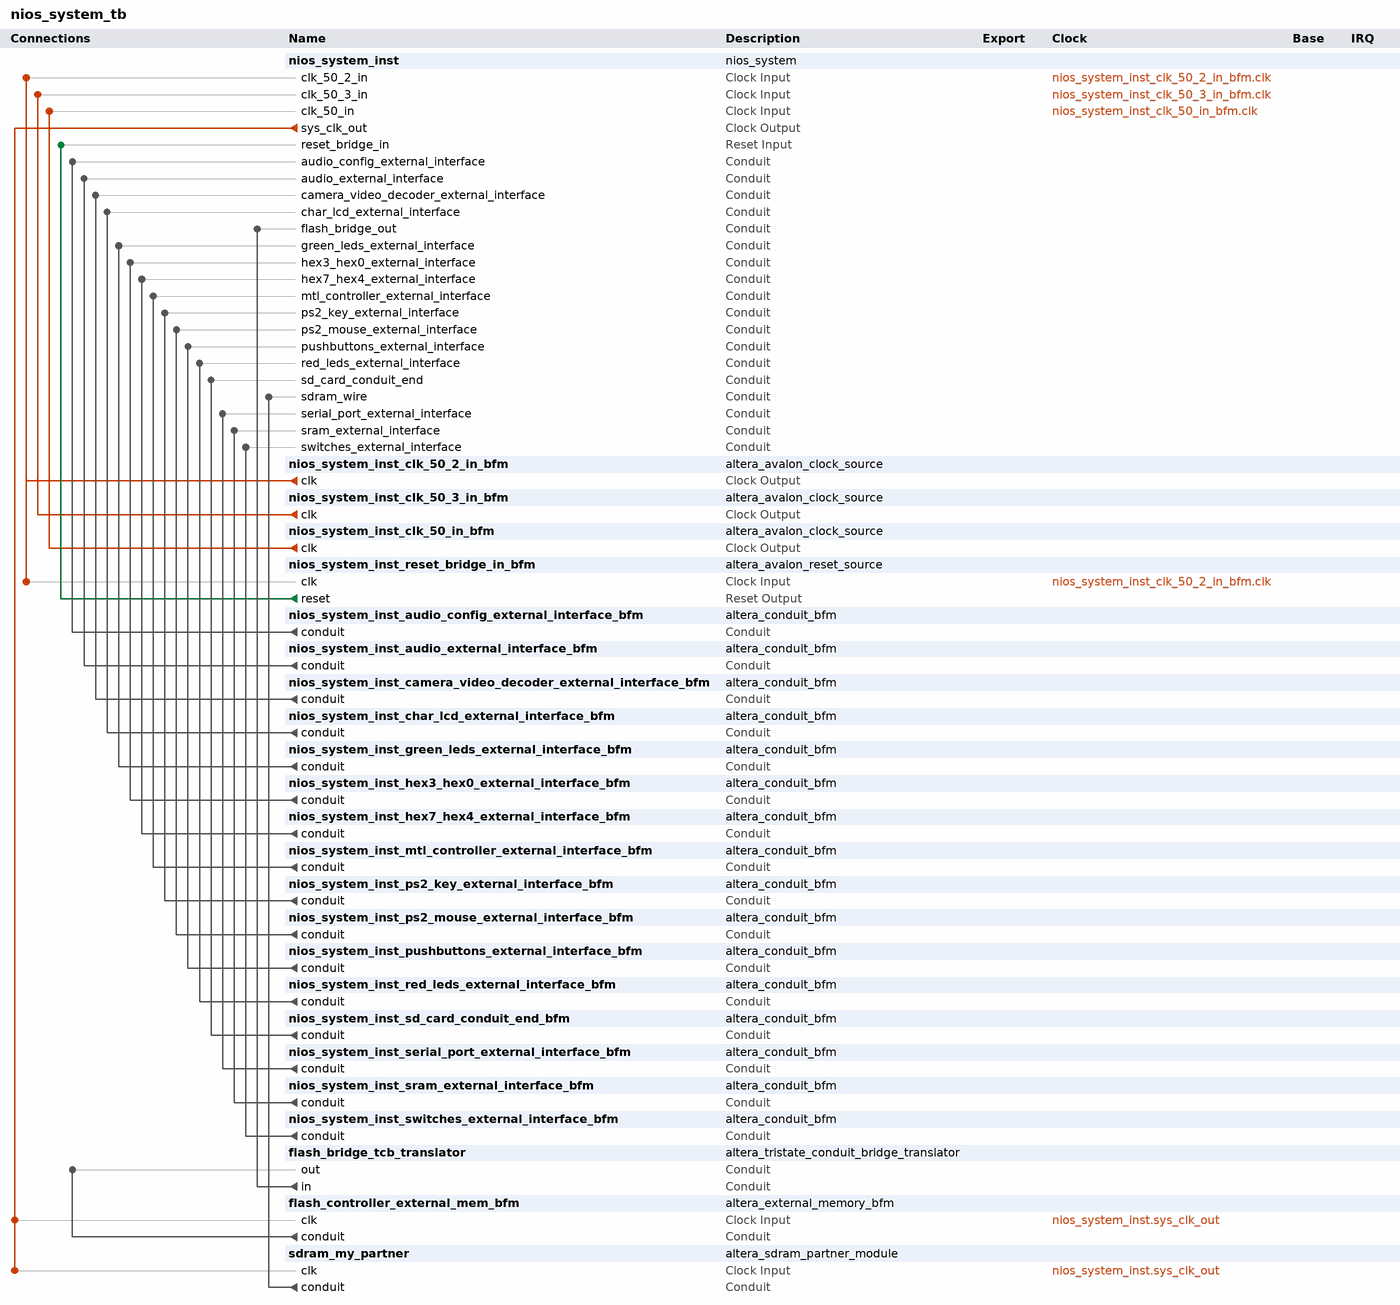
[diagram p0: system contents]
# Platform Designer (Qsys) system nios_system_tb, Cyclone IV E EP4CE115F29C7
# Parameters at their usual value, and those the tool derives, are not listed.
package require -exact qsys 17.1
create_system nios_system_tb
set_project_property DEVICE_FAMILY {Cyclone IV E}
set_project_property DEVICE EP4CE115F29C7

add_instance nios_system_inst nios_system 1.0

add_instance nios_system_inst_clk_50_2_in_bfm altera_avalon_clock_source 17.1

add_instance nios_system_inst_clk_50_3_in_bfm altera_avalon_clock_source 17.1

add_instance nios_system_inst_clk_50_in_bfm altera_avalon_clock_source 17.1

add_instance nios_system_inst_reset_bridge_in_bfm altera_avalon_reset_source 17.1
set_instance_parameter_value nios_system_inst_reset_bridge_in_bfm ASSERT_HIGH_RESET 0
set_instance_parameter_value nios_system_inst_reset_bridge_in_bfm INITIAL_RESET_CYCLES 50

add_instance nios_system_inst_audio_config_external_interface_bfm altera_conduit_bfm 17.1
set_instance_parameter_value nios_system_inst_audio_config_external_interface_bfm CLOCKED_SIGNAL false
set_instance_parameter_value nios_system_inst_audio_config_external_interface_bfm ENABLE_RESET false
set_instance_parameter_value nios_system_inst_audio_config_external_interface_bfm SIGNAL_DIRECTIONS input,bidir
set_instance_parameter_value nios_system_inst_audio_config_external_interface_bfm SIGNAL_ROLES SCLK,SDAT
set_instance_parameter_value nios_system_inst_audio_config_external_interface_bfm SIGNAL_WIDTHS 1,1

add_instance nios_system_inst_audio_external_interface_bfm altera_conduit_bfm 17.1
set_instance_parameter_value nios_system_inst_audio_external_interface_bfm CLOCKED_SIGNAL false
set_instance_parameter_value nios_system_inst_audio_external_interface_bfm ENABLE_RESET false
set_instance_parameter_value nios_system_inst_audio_external_interface_bfm SIGNAL_DIRECTIONS output,output,output,input,output
set_instance_parameter_value nios_system_inst_audio_external_interface_bfm SIGNAL_ROLES ADCDAT,ADCLRCK,BCLK,DACDAT,DACLRCK
set_instance_parameter_value nios_system_inst_audio_external_interface_bfm SIGNAL_WIDTHS 1,1,1,1,1

add_instance nios_system_inst_camera_video_decoder_external_interface_bfm altera_conduit_bfm 17.1
set_instance_parameter_value nios_system_inst_camera_video_decoder_external_interface_bfm CLOCKED_SIGNAL false
set_instance_parameter_value nios_system_inst_camera_video_decoder_external_interface_bfm ENABLE_RESET false
set_instance_parameter_value nios_system_inst_camera_video_decoder_external_interface_bfm SIGNAL_DIRECTIONS output,output,output,input,output,output,input
set_instance_parameter_value nios_system_inst_camera_video_decoder_external_interface_bfm SIGNAL_ROLES TD_CLK27,TD_DATA,TD_HS,TD_RESET,TD_VS,clk27_reset,overflow_flag
set_instance_parameter_value nios_system_inst_camera_video_decoder_external_interface_bfm SIGNAL_WIDTHS 1,8,1,1,1,1,1

add_instance nios_system_inst_char_lcd_external_interface_bfm altera_conduit_bfm 17.1
set_instance_parameter_value nios_system_inst_char_lcd_external_interface_bfm CLOCKED_SIGNAL false
set_instance_parameter_value nios_system_inst_char_lcd_external_interface_bfm ENABLE_RESET false
set_instance_parameter_value nios_system_inst_char_lcd_external_interface_bfm SIGNAL_DIRECTIONS input,bidir,input,input,input,input
set_instance_parameter_value nios_system_inst_char_lcd_external_interface_bfm SIGNAL_ROLES BLON,DATA,EN,ON,RS,RW
set_instance_parameter_value nios_system_inst_char_lcd_external_interface_bfm SIGNAL_WIDTHS 1,8,1,1,1,1

add_instance nios_system_inst_green_leds_external_interface_bfm altera_conduit_bfm 17.1
set_instance_parameter_value nios_system_inst_green_leds_external_interface_bfm CLOCKED_SIGNAL false
set_instance_parameter_value nios_system_inst_green_leds_external_interface_bfm ENABLE_RESET false
set_instance_parameter_value nios_system_inst_green_leds_external_interface_bfm SIGNAL_DIRECTIONS input
set_instance_parameter_value nios_system_inst_green_leds_external_interface_bfm SIGNAL_WIDTHS 9

add_instance nios_system_inst_hex3_hex0_external_interface_bfm altera_conduit_bfm 17.1
set_instance_parameter_value nios_system_inst_hex3_hex0_external_interface_bfm CLOCKED_SIGNAL false
set_instance_parameter_value nios_system_inst_hex3_hex0_external_interface_bfm ENABLE_RESET false
set_instance_parameter_value nios_system_inst_hex3_hex0_external_interface_bfm SIGNAL_DIRECTIONS input,input,input,input
set_instance_parameter_value nios_system_inst_hex3_hex0_external_interface_bfm SIGNAL_ROLES HEX0,HEX1,HEX2,HEX3
set_instance_parameter_value nios_system_inst_hex3_hex0_external_interface_bfm SIGNAL_WIDTHS 7,7,7,7

add_instance nios_system_inst_hex7_hex4_external_interface_bfm altera_conduit_bfm 17.1
set_instance_parameter_value nios_system_inst_hex7_hex4_external_interface_bfm CLOCKED_SIGNAL false
set_instance_parameter_value nios_system_inst_hex7_hex4_external_interface_bfm ENABLE_RESET false
set_instance_parameter_value nios_system_inst_hex7_hex4_external_interface_bfm SIGNAL_DIRECTIONS input,input,input,input
set_instance_parameter_value nios_system_inst_hex7_hex4_external_interface_bfm SIGNAL_ROLES HEX4,HEX5,HEX6,HEX7
set_instance_parameter_value nios_system_inst_hex7_hex4_external_interface_bfm SIGNAL_WIDTHS 7,7,7,7

add_instance nios_system_inst_mtl_controller_external_interface_bfm altera_conduit_bfm 17.1
set_instance_parameter_value nios_system_inst_mtl_controller_external_interface_bfm CLOCKED_SIGNAL false
set_instance_parameter_value nios_system_inst_mtl_controller_external_interface_bfm ENABLE_RESET false
set_instance_parameter_value nios_system_inst_mtl_controller_external_interface_bfm SIGNAL_DIRECTIONS input,input,input,input,input,input,input
set_instance_parameter_value nios_system_inst_mtl_controller_external_interface_bfm SIGNAL_ROLES B,CLK,DATA_EN,G,HS,R,VS
set_instance_parameter_value nios_system_inst_mtl_controller_external_interface_bfm SIGNAL_WIDTHS 8,1,1,8,1,8,1

add_instance nios_system_inst_ps2_key_external_interface_bfm altera_conduit_bfm 17.1
set_instance_parameter_value nios_system_inst_ps2_key_external_interface_bfm CLOCKED_SIGNAL false
set_instance_parameter_value nios_system_inst_ps2_key_external_interface_bfm ENABLE_RESET false
set_instance_parameter_value nios_system_inst_ps2_key_external_interface_bfm SIGNAL_DIRECTIONS bidir,bidir
set_instance_parameter_value nios_system_inst_ps2_key_external_interface_bfm SIGNAL_ROLES CLK,DAT
set_instance_parameter_value nios_system_inst_ps2_key_external_interface_bfm SIGNAL_WIDTHS 1,1

add_instance nios_system_inst_ps2_mouse_external_interface_bfm altera_conduit_bfm 17.1
set_instance_parameter_value nios_system_inst_ps2_mouse_external_interface_bfm CLOCKED_SIGNAL false
set_instance_parameter_value nios_system_inst_ps2_mouse_external_interface_bfm ENABLE_RESET false
set_instance_parameter_value nios_system_inst_ps2_mouse_external_interface_bfm SIGNAL_DIRECTIONS bidir,bidir
set_instance_parameter_value nios_system_inst_ps2_mouse_external_interface_bfm SIGNAL_ROLES CLK,DAT
set_instance_parameter_value nios_system_inst_ps2_mouse_external_interface_bfm SIGNAL_WIDTHS 1,1

add_instance nios_system_inst_pushbuttons_external_interface_bfm altera_conduit_bfm 17.1
set_instance_parameter_value nios_system_inst_pushbuttons_external_interface_bfm CLOCKED_SIGNAL false
set_instance_parameter_value nios_system_inst_pushbuttons_external_interface_bfm ENABLE_RESET false
set_instance_parameter_value nios_system_inst_pushbuttons_external_interface_bfm SIGNAL_DIRECTIONS output
set_instance_parameter_value nios_system_inst_pushbuttons_external_interface_bfm SIGNAL_WIDTHS 4

add_instance nios_system_inst_red_leds_external_interface_bfm altera_conduit_bfm 17.1
set_instance_parameter_value nios_system_inst_red_leds_external_interface_bfm CLOCKED_SIGNAL false
set_instance_parameter_value nios_system_inst_red_leds_external_interface_bfm ENABLE_RESET false
set_instance_parameter_value nios_system_inst_red_leds_external_interface_bfm SIGNAL_DIRECTIONS input
set_instance_parameter_value nios_system_inst_red_leds_external_interface_bfm SIGNAL_WIDTHS 18

add_instance nios_system_inst_sd_card_conduit_end_bfm altera_conduit_bfm 17.1
set_instance_parameter_value nios_system_inst_sd_card_conduit_end_bfm CLOCKED_SIGNAL false
set_instance_parameter_value nios_system_inst_sd_card_conduit_end_bfm ENABLE_RESET false
set_instance_parameter_value nios_system_inst_sd_card_conduit_end_bfm SIGNAL_DIRECTIONS bidir,bidir,bidir,input
set_instance_parameter_value nios_system_inst_sd_card_conduit_end_bfm SIGNAL_ROLES b_SD_cmd,b_SD_dat,b_SD_dat3,o_SD_clock
set_instance_parameter_value nios_system_inst_sd_card_conduit_end_bfm SIGNAL_WIDTHS 1,1,1,1

add_instance nios_system_inst_serial_port_external_interface_bfm altera_conduit_bfm 17.1
set_instance_parameter_value nios_system_inst_serial_port_external_interface_bfm CLOCKED_SIGNAL false
set_instance_parameter_value nios_system_inst_serial_port_external_interface_bfm ENABLE_RESET false
set_instance_parameter_value nios_system_inst_serial_port_external_interface_bfm SIGNAL_DIRECTIONS output,input
set_instance_parameter_value nios_system_inst_serial_port_external_interface_bfm SIGNAL_ROLES RXD,TXD
set_instance_parameter_value nios_system_inst_serial_port_external_interface_bfm SIGNAL_WIDTHS 1,1

add_instance nios_system_inst_sram_external_interface_bfm altera_conduit_bfm 17.1
set_instance_parameter_value nios_system_inst_sram_external_interface_bfm CLOCKED_SIGNAL false
set_instance_parameter_value nios_system_inst_sram_external_interface_bfm ENABLE_RESET false
set_instance_parameter_value nios_system_inst_sram_external_interface_bfm SIGNAL_DIRECTIONS input,input,bidir,input,input,input,input
set_instance_parameter_value nios_system_inst_sram_external_interface_bfm SIGNAL_ROLES ADDR,CE_N,DQ,LB_N,OE_N,UB_N,WE_N
set_instance_parameter_value nios_system_inst_sram_external_interface_bfm SIGNAL_WIDTHS 20,1,16,1,1,1,1

add_instance nios_system_inst_switches_external_interface_bfm altera_conduit_bfm 17.1
set_instance_parameter_value nios_system_inst_switches_external_interface_bfm CLOCKED_SIGNAL false
set_instance_parameter_value nios_system_inst_switches_external_interface_bfm ENABLE_RESET false
set_instance_parameter_value nios_system_inst_switches_external_interface_bfm SIGNAL_DIRECTIONS output
set_instance_parameter_value nios_system_inst_switches_external_interface_bfm SIGNAL_WIDTHS 18

add_instance flash_bridge_tcb_translator altera_tristate_conduit_bridge_translator 17.1
set_instance_parameter_value flash_bridge_tcb_translator CHAIN_LENGTH 4
set_instance_parameter_value flash_bridge_tcb_translator MODULE_ORIGIN_LIST flash_controller.tcm,flash_controller.tcm,flash_controller.tcm,flash_controller.tcm,flash_controller.tcm
set_instance_parameter_value flash_bridge_tcb_translator SIGNAL_ORIGIN_LIST tcm_address_out,tcm_read_n_out,tcm_write_n_out,tcm_data_out,tcm_chipselect_n_out
set_instance_parameter_value flash_bridge_tcb_translator SIGNAL_ORIGIN_TYPE Output,Output,Output,Bidirectional,Output
set_instance_parameter_value flash_bridge_tcb_translator SIGNAL_ORIGIN_WIDTH 23,1,1,8,1

add_instance flash_controller_external_mem_bfm altera_external_memory_bfm 17.1
set_instance_parameter_value flash_controller_external_mem_bfm ACTIVE_LOW_BEGINTRANSFER 0
set_instance_parameter_value flash_controller_external_mem_bfm ACTIVE_LOW_BYTEENABLE 0
set_instance_parameter_value flash_controller_external_mem_bfm ACTIVE_LOW_CHIPSELECT 1
set_instance_parameter_value flash_controller_external_mem_bfm ACTIVE_LOW_OUTPUTENABLE 0
set_instance_parameter_value flash_controller_external_mem_bfm ACTIVE_LOW_READ 1
set_instance_parameter_value flash_controller_external_mem_bfm ACTIVE_LOW_RESET 0
set_instance_parameter_value flash_controller_external_mem_bfm ACTIVE_LOW_WRITE 1
set_instance_parameter_value flash_controller_external_mem_bfm CDT_ADDRESS_W 23
set_instance_parameter_value flash_controller_external_mem_bfm CDT_NUMSYMBOLS 1
set_instance_parameter_value flash_controller_external_mem_bfm CDT_READ_LATENCY 0
set_instance_parameter_value flash_controller_external_mem_bfm CDT_SYMBOL_W 8
set_instance_parameter_value flash_controller_external_mem_bfm INIT_FILE altera_external_memory_bfm.hex
set_instance_parameter_value flash_controller_external_mem_bfm SIGNAL_ADDRESS_ROLES tcm_address_out
set_instance_parameter_value flash_controller_external_mem_bfm SIGNAL_BEGINTRANSFER_ROLES tcm_begintransfer_out
set_instance_parameter_value flash_controller_external_mem_bfm SIGNAL_BYTEENABLE_ROLES tcm_byteenable_out
set_instance_parameter_value flash_controller_external_mem_bfm SIGNAL_CHIPSELECT_ROLES tcm_chipselect_n_out
set_instance_parameter_value flash_controller_external_mem_bfm SIGNAL_DATA_ROLES tcm_data_out
set_instance_parameter_value flash_controller_external_mem_bfm SIGNAL_OUTPUTENABLE_ROLES tcm_outputenable_out
set_instance_parameter_value flash_controller_external_mem_bfm SIGNAL_READ_ROLES tcm_read_n_out
set_instance_parameter_value flash_controller_external_mem_bfm SIGNAL_RESET_ROLES tcm_reset_out
set_instance_parameter_value flash_controller_external_mem_bfm SIGNAL_WRITE_ROLES tcm_write_n_out
set_instance_parameter_value flash_controller_external_mem_bfm USE_BEGINTRANSFER 0
set_instance_parameter_value flash_controller_external_mem_bfm USE_BYTEENABLE 0
set_instance_parameter_value flash_controller_external_mem_bfm USE_CHIPSELECT 1
set_instance_parameter_value flash_controller_external_mem_bfm USE_OUTPUTENABLE 0
set_instance_parameter_value flash_controller_external_mem_bfm USE_READ 1
set_instance_parameter_value flash_controller_external_mem_bfm USE_RESET 0
set_instance_parameter_value flash_controller_external_mem_bfm USE_WRITE 1
set_instance_parameter_value flash_controller_external_mem_bfm VHDL_ID 0

add_instance sdram_my_partner altera_sdram_partner_module 11.0
set_instance_parameter_value sdram_my_partner CONTR_NAME nios_system_sdram
set_instance_parameter_value sdram_my_partner SDRAM_COL_WIDTH 10
set_instance_parameter_value sdram_my_partner SDRAM_DATA_WIDTH 32
set_instance_parameter_value sdram_my_partner SDRAM_ROW_WIDTH 13

# connections
add_connection nios_system_inst.sys_clk_out flash_controller_external_mem_bfm.clk clock
add_connection nios_system_inst.sys_clk_out sdram_my_partner.clk clock
add_connection nios_system_inst_clk_50_2_in_bfm.clk nios_system_inst.clk_50_2_in clock
add_connection nios_system_inst_clk_50_2_in_bfm.clk nios_system_inst_reset_bridge_in_bfm.clk clock
add_connection nios_system_inst_clk_50_3_in_bfm.clk nios_system_inst.clk_50_3_in clock
add_connection nios_system_inst_clk_50_in_bfm.clk nios_system_inst.clk_50_in clock
add_connection nios_system_inst_reset_bridge_in_bfm.reset nios_system_inst.reset_bridge_in reset
add_connection flash_bridge_tcb_translator.in nios_system_inst.flash_bridge_out conduit
add_connection flash_controller_external_mem_bfm.conduit flash_bridge_tcb_translator.out conduit
add_connection nios_system_inst_audio_config_external_interface_bfm.conduit nios_system_inst.audio_config_external_interface conduit
add_connection nios_system_inst_audio_external_interface_bfm.conduit nios_system_inst.audio_external_interface conduit
add_connection nios_system_inst_camera_video_decoder_external_interface_bfm.conduit nios_system_inst.camera_video_decoder_external_interface conduit
add_connection nios_system_inst_char_lcd_external_interface_bfm.conduit nios_system_inst.char_lcd_external_interface conduit
add_connection nios_system_inst_green_leds_external_interface_bfm.conduit nios_system_inst.green_leds_external_interface conduit
add_connection nios_system_inst_hex3_hex0_external_interface_bfm.conduit nios_system_inst.hex3_hex0_external_interface conduit
add_connection nios_system_inst_hex7_hex4_external_interface_bfm.conduit nios_system_inst.hex7_hex4_external_interface conduit
add_connection nios_system_inst_mtl_controller_external_interface_bfm.conduit nios_system_inst.mtl_controller_external_interface conduit
add_connection nios_system_inst_ps2_key_external_interface_bfm.conduit nios_system_inst.ps2_key_external_interface conduit
add_connection nios_system_inst_ps2_mouse_external_interface_bfm.conduit nios_system_inst.ps2_mouse_external_interface conduit
add_connection nios_system_inst_pushbuttons_external_interface_bfm.conduit nios_system_inst.pushbuttons_external_interface conduit
add_connection nios_system_inst_red_leds_external_interface_bfm.conduit nios_system_inst.red_leds_external_interface conduit
add_connection nios_system_inst_sd_card_conduit_end_bfm.conduit nios_system_inst.sd_card_conduit_end conduit
add_connection nios_system_inst_serial_port_external_interface_bfm.conduit nios_system_inst.serial_port_external_interface conduit
add_connection nios_system_inst_sram_external_interface_bfm.conduit nios_system_inst.sram_external_interface conduit
add_connection nios_system_inst_switches_external_interface_bfm.conduit nios_system_inst.switches_external_interface conduit
add_connection sdram_my_partner.conduit nios_system_inst.sdram_wire conduit

set_interconnect_requirement {$system} qsys_mm.clockCrossingAdapter HANDSHAKE
set_interconnect_requirement {$system} qsys_mm.enableEccProtection FALSE
set_interconnect_requirement {$system} qsys_mm.insertDefaultSlave FALSE
set_interconnect_requirement {$system} qsys_mm.maxAdditionalLatency 1

save_system nios_system_tb.qsys
